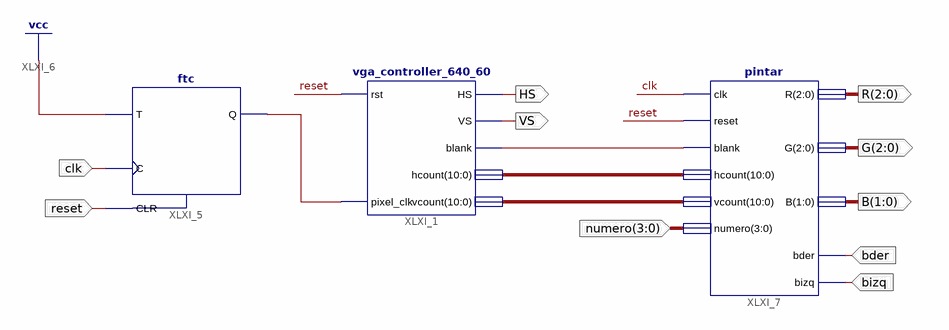
[diagram p0: schematic sheet 1]
// Xilinx ISE schematic VGAT.sch (spartan3e) as structural Verilog: 3 symbols, 10 ports
module VGAT (
  input  clk,
  input  reset,
  input  [3:0] numero,
  input  bder,
  input  bizq,
  output HS,
  output VS,
  output [2:0] R,
  output [2:0] G,
  output [1:0] B
);

  wire XLXN_7, XLXN_11;
  wire [10:0] XLXN_12, XLXN_13;

  vga_controller_640_60 XLXI_1 (
    .rst(reset), .pixel_clk(XLXN_7), .HS(HS), .VS(VS), .blank(XLXN_11), .hcount(XLXN_12), .vcount(XLXN_13));
  ftc XLXI_5 (.C(clk), .CLR(reset), .T(1'b1), .Q(XLXN_7));
  pintar XLXI_7 (
    .clk(clk), .reset(reset), .blank(XLXN_11), .bder(bder), .bizq(bizq), .numero(numero), .hcount(XLXN_12),
    .vcount(XLXN_13), .R(R), .G(G), .B(B));
endmodule
